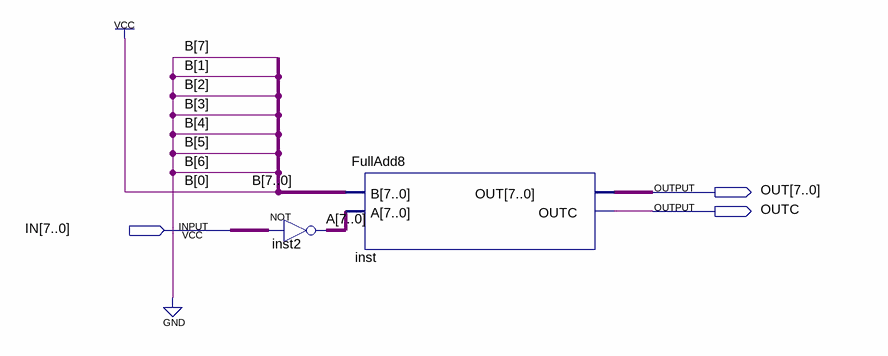
[diagram p0: schematic sheet]
// Quartus schematic Comp2.bdf as structural Verilog: 2 symbols, 3 pins
module Comp2 (
  input  [7:0] IN,
  output [7:0] OUT,
  output OUTC
);

  wire [7:0] A;

  assign A = ~IN;  // NOT inst2, 8 bits wide
  FullAdd8 inst (.B(8'b00000001), .A(A), .OUT(OUT), .OUTC(OUTC));
endmodule
